# Altium schematic sheet Sync In.SchDoc
size 297 x 209 mm; SheetNumber: 22; SheetTotal: 29
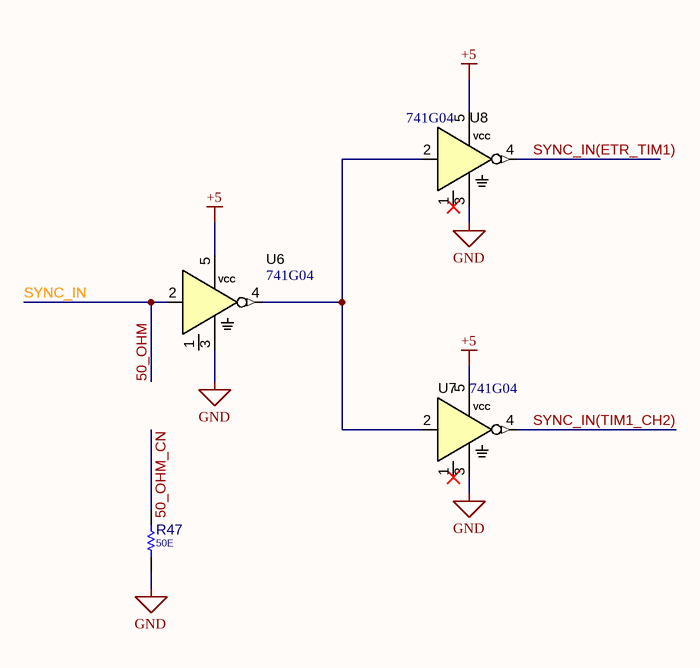
[diagram p0: Sync In.SchDoc]

## Parts
R47  50E  [R0603]
U6  741G04  [SOT353_5]
U7  741G04  [SOT353_5]
U8  741G04  [SOT353_5]

## Nets
+5: U6.5(VCC) U7.5(VCC) U8.5(VCC)
GND: R47.2 U6.3(GND) U7.3(GND) U8.3(GND)
50_OHM: U6.2(A)  [also labelled SYNC_IN]
50_OHM_CN: R47.1
SYNC_IN(ETR_TIM1): U8.4(Y)
SYNC_IN(TIM1_CH2): U7.4(Y)
NetU6_4: U6.4(Y) U7.2(A) U8.2(A)

Not connected (* = marked no-connect by the designer): U6 1(NC); U7 1(NC)*; U8 1(NC)*

## Notes on the sheet
- Drawn
- Name
- Date
- Drawing Title
- Checked
- Drawing No.
- Approved
- Size
- A4
- Ver.
- Rev.
- Sheet
- Of

## Library data of the parts
R47 = RES_SMD_0603: RESISTOR, SMD; PARAM: -W; DESC: DESCRIPTION; DIST#: MOUSER; PARAM2: 1%; MANF_P#: -; MANF: -; ASSEMBLY: ASSEMBLY; PRICE: 100= 0.5$; VALUE: 50E
U6-U8 = NOT_SN74LVC1G04_SOT353: GATE, NOT, SINGLE, SOT353 SMD; MANF: Texas Instruments; MANF_P#: SN74LVC1GU04DCK; PARAM2: 2~5.5V; VALUE: 741G04